# Altium schematic sheet Procesador_3.SchDoc
size A4
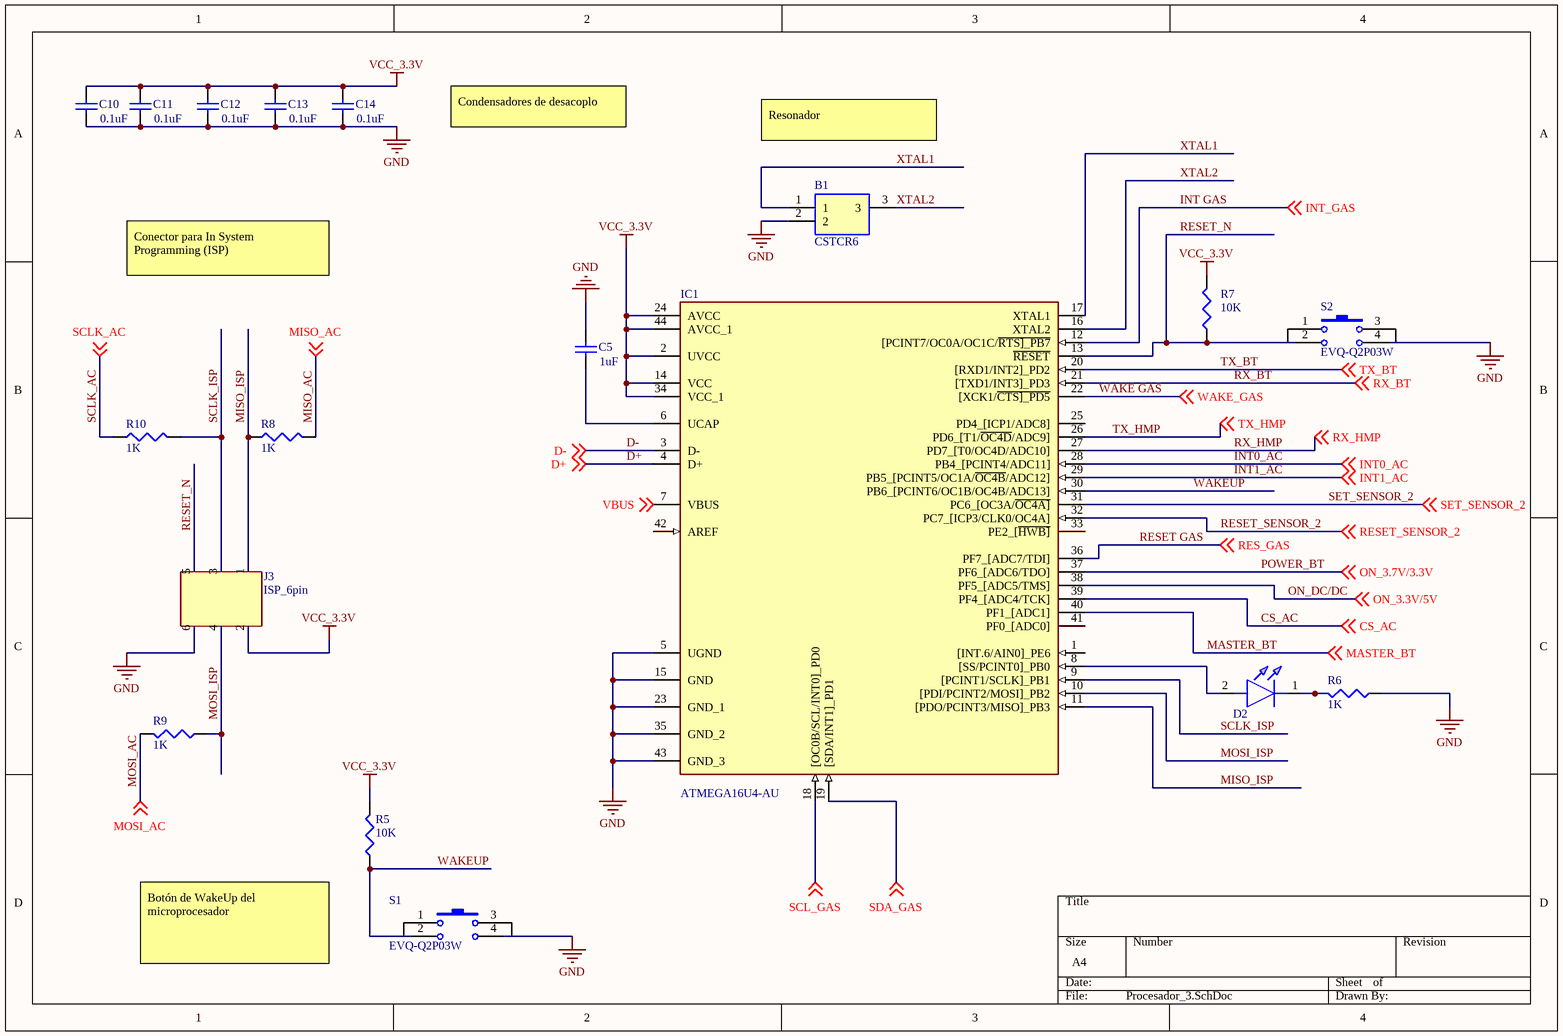
[diagram p0: Procesador_3.SchDoc]

## Parts
B1  CSTCR6  [CSTCR6M00G53]
C5  value 1uF  [0603]  (hidden comment: Cap)
C10  value 0.1uF  [0603]  (hidden comment: Cap)
C11  value 0.1uF  [0603]  (hidden comment: Cap)
C12  value 0.1uF  [0603]  (hidden comment: Cap)
C13  value 0.1uF  [0603]  (hidden comment: Cap)
C14  value 0.1uF  [0603]  (hidden comment: Cap)
D2  150060GS75000  [LEDC1608X80N]  (value not drawn)
IC1  ATMEGA16U4-AU  [ATMEGA 16U4]
J3  ISP_6pin  [ISP_6PIN]
R5  value 10K  [0603]  (hidden comment: Res3)
R6  value 1K  [0603]  (hidden comment: Res3)
R7  value 10K  [0603]  (hidden comment: Res3)
R8  value 1K  [0603]  (hidden comment: Res3)
R9  value 1K  [0603]  (hidden comment: Res3)
R10  value 1K  [0603]  (hidden comment: Res3)
S1  EVQ-Q2P03W  [EVQ-Q2P03W]
S2  EVQ-Q2P03W  [EVQ-Q2P03W]

## Nets
GND: B1.2 C5.2 C10.1 C11.1 C12.1 C13.1 C14.1 IC1.5(UGND) IC1.15(GND) IC1.23(GND_1) IC1.35(GND_2) IC1.43(GND_3) J3.6 R6.1 S1.4 S2.4
VCC_3.3V: C10.2 C11.2 C12.2 C13.2 C14.2 IC1.2(UVCC) IC1.14(VCC) IC1.24(AVCC) IC1.34(VCC_1) IC1.44(AVCC_1) J3.2 R5.2 R7.2
CS_AC: IC1.39(PF4_[ADC4/TCK]) ; off-sheet CS_AC
D+: IC1.4(D+) ; off-sheet D+
D-: IC1.3(D-) ; off-sheet D-
INT0_AC: IC1.28(PB4_[PCINT4/ADC11]) ; off-sheet INT0_AC
INT1_AC: IC1.29(PB5_[PCINT5/OC1A/~{OC4B}/ADC12]) ; off-sheet INT1_AC
INT GAS: IC1.12([PCINT7/OC0A/OC1C/~{RTS]_PB7}) ; off-sheet INT_GAS  [also labelled INT_GAS]
MASTER_BT: IC1.40(PF1_[ADC1]) ; off-sheet MASTER_BT
MISO_AC: R8.2 ; off-sheet MISO_AC
MISO_ISP: IC1.11([PDO/PCINT3/MISO]_PB3) J3.1 R8.1
MOSI_AC: R9.2 ; off-sheet MOSI_AC
MOSI_ISP: IC1.10([PDI/PCINT2/MOSI]_PB2) J3.4 R9.1
ON_DC/DC: IC1.38(PF5_[ADC5/TMS]) ; off-sheet ON_3.3V/5V  [also labelled ON_3.3V/5V]
POWER_BT: IC1.37(PF6_[ADC6/TDO]) ; off-sheet ON_3.7V/3.3V  [also labelled ON_3.7V/3.3V]
RESET GAS: IC1.36(PF7_[ADC7/TDI]) ; off-sheet RES_GAS  [also labelled RES_GAS]
RESET_N: IC1.13(~{RESET}) J3.5 R7.1 S2.2
RESET_SENSOR_2: IC1.32(PC7_[ICP3/CLK0/OC4A]) ; off-sheet RESET_SENSOR_2
RX_BT: IC1.21([TXD1/INT3]_PD3) ; off-sheet RX_BT
RX_HMP: IC1.27(PD7_[T0/OC4D/ADC10]) ; off-sheet RX_HMP
SCL_GAS: IC1.18([OC0B/SCL/INT0]_PD0) ; off-sheet SCL_GAS
SCLK_AC: R10.1 ; off-sheet SCLK_AC
SCLK_ISP: IC1.9([PCINT1/SCLK]_PB1) J3.3 R10.2
SDA_GAS: IC1.19([SDA/INT1]_PD1) ; off-sheet SDA_GAS
SET_SENSOR_2: IC1.31(PC6_[OC3A/~{OC4A]}) ; off-sheet SET_SENSOR_2
TX_BT: IC1.20([RXD1/INT2]_PD2) ; off-sheet TX_BT
TX_HMP: IC1.26(PD6_[T1/~{OC4D}/ADC9]) ; off-sheet TX_HMP
VBUS: IC1.7(VBUS) ; off-sheet VBUS
WAKE GAS: IC1.22([XCK1/~{CTS]_PD5}) ; off-sheet WAKE_GAS  [also labelled WAKE_GAS]
WAKEUP: IC1.30(PB6_[PCINT6/OC1B/OC4B/ADC13]) R5.1 S1.2
XTAL1: B1.1 IC1.17(XTAL1)
XTAL2: B1.3 IC1.16(XTAL2)
NetC5_1: C5.1 IC1.6(UCAP)
NetD2_1: D2.1(K) R6.2
NetD2_2: D2.2(A) IC1.8([SS/PCINT0]_PB0)

Not connected (* = marked no-connect by the designer): IC1 1([INT.6/AIN0]_PE6) 25(PD4_[ICP1/ADC8]) 33(PE2_[~{HWB]}) 41(PF0_[ADC0]) 42(AREF); S1 1 3; S2 1 3

## Notes on the sheet
- Condensadores de desacoplo
- Resonador
- Conector para In System Programming (ISP)
- (near R5) Botón de WakeUp del microprocesador

## Library data of the parts
B1 = CSTCE16M0V53C-R0: SMD Ceramic Resonator 16 MHz 15PF CSTCE16M0V53C-R0, Ceramic Resonator, 16MHz Expander 15pF, 4-Pin, 3.2 x 1.3 x 0.9mm; Manufacturer_Name: Murata Electronics; Geometry.Height: 1mm; Mouser Part Number: 81-CSTCE16M0V53C-R0; Manufacturer_Part_Number: CSTCE16M0V53C-R0; Datasheet Link: https://componentsearchengine.com/Datasheets/1/CSTCE16M0V53C-R0.pdf; Supplier 1: RSComponents; Supplier Part Number 1: 7926530; Supplier 2: Digi-Key; Supplier Part Number 2: 490-1204-1-ND
C5 C10-C14 = Cap_0603: Capacitor; Published: 8-Jun-2000; LatestRevisionDate: 17-Jul-2002; LatestRevisionNote: Re-released for DXP Platform.; PackageReference: RAD-0.3; Publisher: Altium Limited; PackageDescription: Radial Cap, Thru-Hole; 2 Leads; 0.3 in Pin Spacing; Supplier 1: RSComponents; Supplier 2: Digi-Key
  C5: Supplier Part Number 1: 4612708; Supplier Part Number 2: 478-1251-1-ND
  C10: Supplier Part Number 1: 147538; Supplier Part Number 2: 399-1281-1-ND
  C11-C14: Supplier Part Number 1: 8015205; Supplier Part Number 2: 399-1095-1-ND
D2 = 150060GS75000: Wurth Elektronik WL-SMCW 520 nm Green LED, 1608 (0603) Clear SMD package; Geometry.Height: 0.8mm; Manufacturer_Name: Wurth Elektronik; Manufacturer_Part_Number: 150060GS75000; RS Part Number: 8154209P; RS Price/Stock: http://uk.rs-online.com/web/p/products/8154209P; Arrow Part Number: 150060GS75000; Arrow Price/Stock: http://uk.rs-online.com/web/p/products/8154209P; Datasheet Link: https://componentsearchengine.com/Datasheets/2/150060GS75000.pdf; Supplier 1: RSComponents; Supplier Part Number 1: 6973715; Supplier 2: Digi-Key; Supplier Part Number 2: 732-4971-1-ND
IC1 = ATMEGA16U4-AU: Integrated Circuit; Manufacturer_Name: Microchip; Datasheet Link: http://www.atmel.com/images/atmel-7766-8-bit-avr-atmega16u4-32u4_summary.pdf; Height: 1.2mm; Manufacturer_Part_Number: ATMEGA16U4-AU; Supplier 1: RSComponents; Supplier Part Number 1: 1773649; Supplier 2: Digi-Key; Supplier Part Number 2: ATMEGA16U4-AU-ND
R5-R10 = Res3: Resistor; Published: 8-Jun-2000; LatestRevisionDate: 29-May-2009; LatestRevisionNote: IPC-7351 Footprint Added.; PackageReference: J1-0603; Publisher: Altium Limited; PackageDescription: Chip Resistor; Supplier 1: RSComponents; Supplier 2: Digi-Key
  R5 R7: Supplier Part Number 1: 1251173; Supplier Part Number 2: P10.0KHDKR-ND
  R6 R8-R10: Supplier Part Number 1: 8145889; Supplier Part Number 2: P1.00KHCT-ND
S1 S2 = EVQ-Q2P03W: Tactile 3.1 heigth; Manufacturer_Part_Number: EVQP2602W; Vendor: Panasonic; Built_By: EMA_UL_Team; C: Copyright (C) 2015 Accelerated Designs. All rights reserved; RefDes: RefDes; Type: DEV; Value: Value; Supplier 1: RSComponents; Supplier Part Number 1: 7561858; Supplier 2: Digi-Key; Supplier Part Number 2: P12949SCT-ND
J3 = ISP_6pin: Supplier 1: Mouser; Supplier Part Number 1: 571-5-146130-2; Supplier 2: Digi-Key; Supplier Part Number 2: 5-146130-2-ND